# EAGLE schematic board (EAGLE 6.5.0)
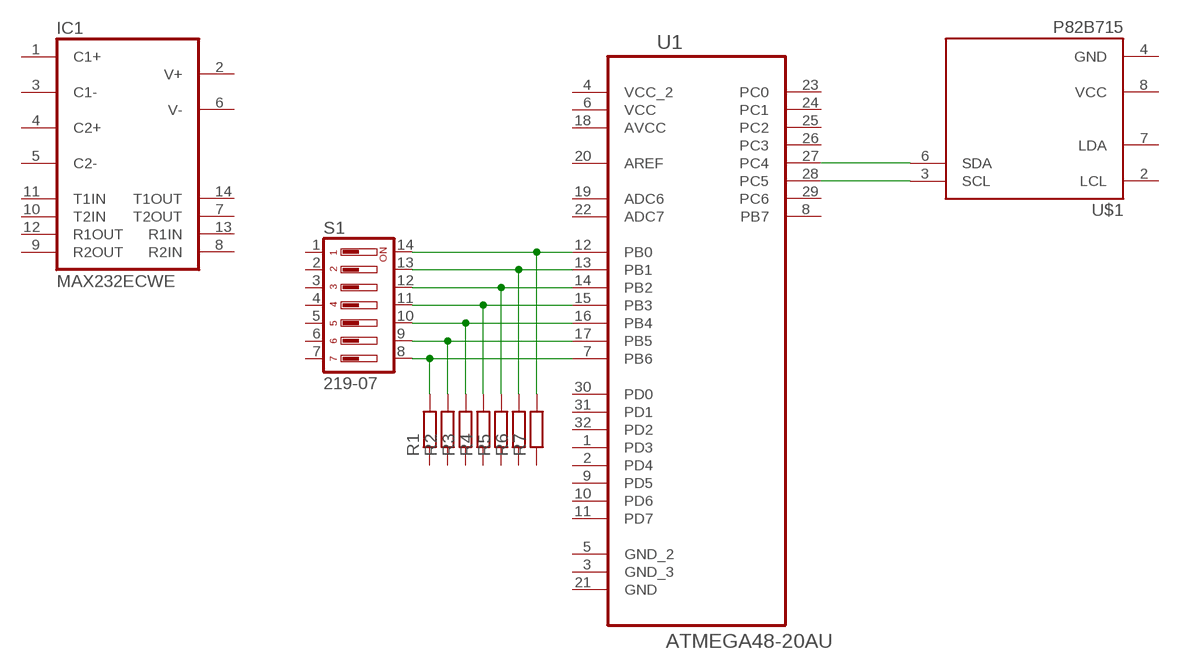
[diagram p0: schematic, sheet 1]

## Parts
IC1  MAX232ECWE  [SO16L]
R1  R-EU_R1206  [R1206]
R2  R-EU_R1206  [R1206]
R3  R-EU_R1206  [R1206]
R4  R-EU_R1206  [R1206]
R5  R-EU_R1206  [R1206]
R6  R-EU_R1206  [R1206]
R7  R-EU_R1206  [R1206]
S1  219-07  [CTS-219-07]
U1  ATMEGA48-20AU  [QFP80P900X900X120-32N]
U$1  P82B715  [P82B715SMD]

## Nets
N$1: U1.28(PC5) U$1.3(SCL)
N$2: U1.27(PC4) U$1.6(SDA)
N$3: R1.2 S1.8 U1.7(PB6)
N$4: R2.2 S1.9 U1.17(PB5)
N$5: R3.2 S1.10 U1.16(PB4)
N$6: R4.2 S1.11 U1.15(PB3)
N$7: R5.2 S1.12 U1.14(PB2)
N$8: R6.2 S1.13 U1.13(PB1)
N$9: R7.2 S1.14 U1.12(PB0)
Unconnected: IC1.1(C1+) IC1.2(V+) IC1.3(C1-) IC1.4(C2+) IC1.5(C2-) IC1.6(V-) IC1.7(T2OUT) IC1.8(R2IN) IC1.9(R2OUT) IC1.10(T2IN) IC1.11(T1IN) IC1.12(R1OUT) IC1.13(R1IN) IC1.14(T1OUT) R1.1 R2.1 R3.1 R4.1 R5.1 R6.1 R7.1 S1.1 S1.2 S1.3 S1.4 S1.5 S1.6 S1.7 U1.1(PD3) U1.2(PD4) U1.3(GND_3) U1.5(GND_2) U1.8(PB7) U1.9(PD5) U1.10(PD6) U1.11(PD7) U1.19(ADC6) U1.20(AREF) U1.21(GND) U1.22(ADC7) U1.23(PC0) U1.24(PC1) U1.25(PC2) U1.26(PC3) U1.29(PC6) U1.30(PD0) U1.31(PD1) U1.32(PD2) U$1.2(LCL) U$1.7(LDA)

## Power pins joined to a net without a drawn wire
AVCC: U1.18(AVCC)
GND: IC1.15(GND) U$1.4(GND)
VCC: IC1.16(VCC) U1.6(VCC) U$1.8(VCC)
VCC_2: U1.4(VCC_2)

## Library data of the parts
IC1 = maxim:MAX232ECWE: RS232 TRANSCEIVER; MF: MAXIM; MPN: MAX232ECWE+; OC_FARNELL: 9724435; OC_NEWARK: 67K4440
R1-R7 = rcl:R-EU_: RESISTOR, European symbol
S1 = switch-dil:219-07*: Surface Mount DIP Switch Series 219 SMT CTS Electronic Components Sourc: www.ctscorp.com; OC_FARNELL: unknown; OC_NEWARK: unknown
U1 = atmega48:ATMEGA48-20AU: 8-bit Microcontroller with 8K Bytes In-System Programmable Flash; MPN: ATMEGA48-20AU; OC_FARNELL: 9171312; OC_NEWARK: 73K2002; PACKAGE: TQFP-32; SUPPLIER: Aymel
U$1 = i2c:P82B715